# EAGLE design USB-to-Quad-RS-485-Conv-Module (EAGLE 9.6.2)
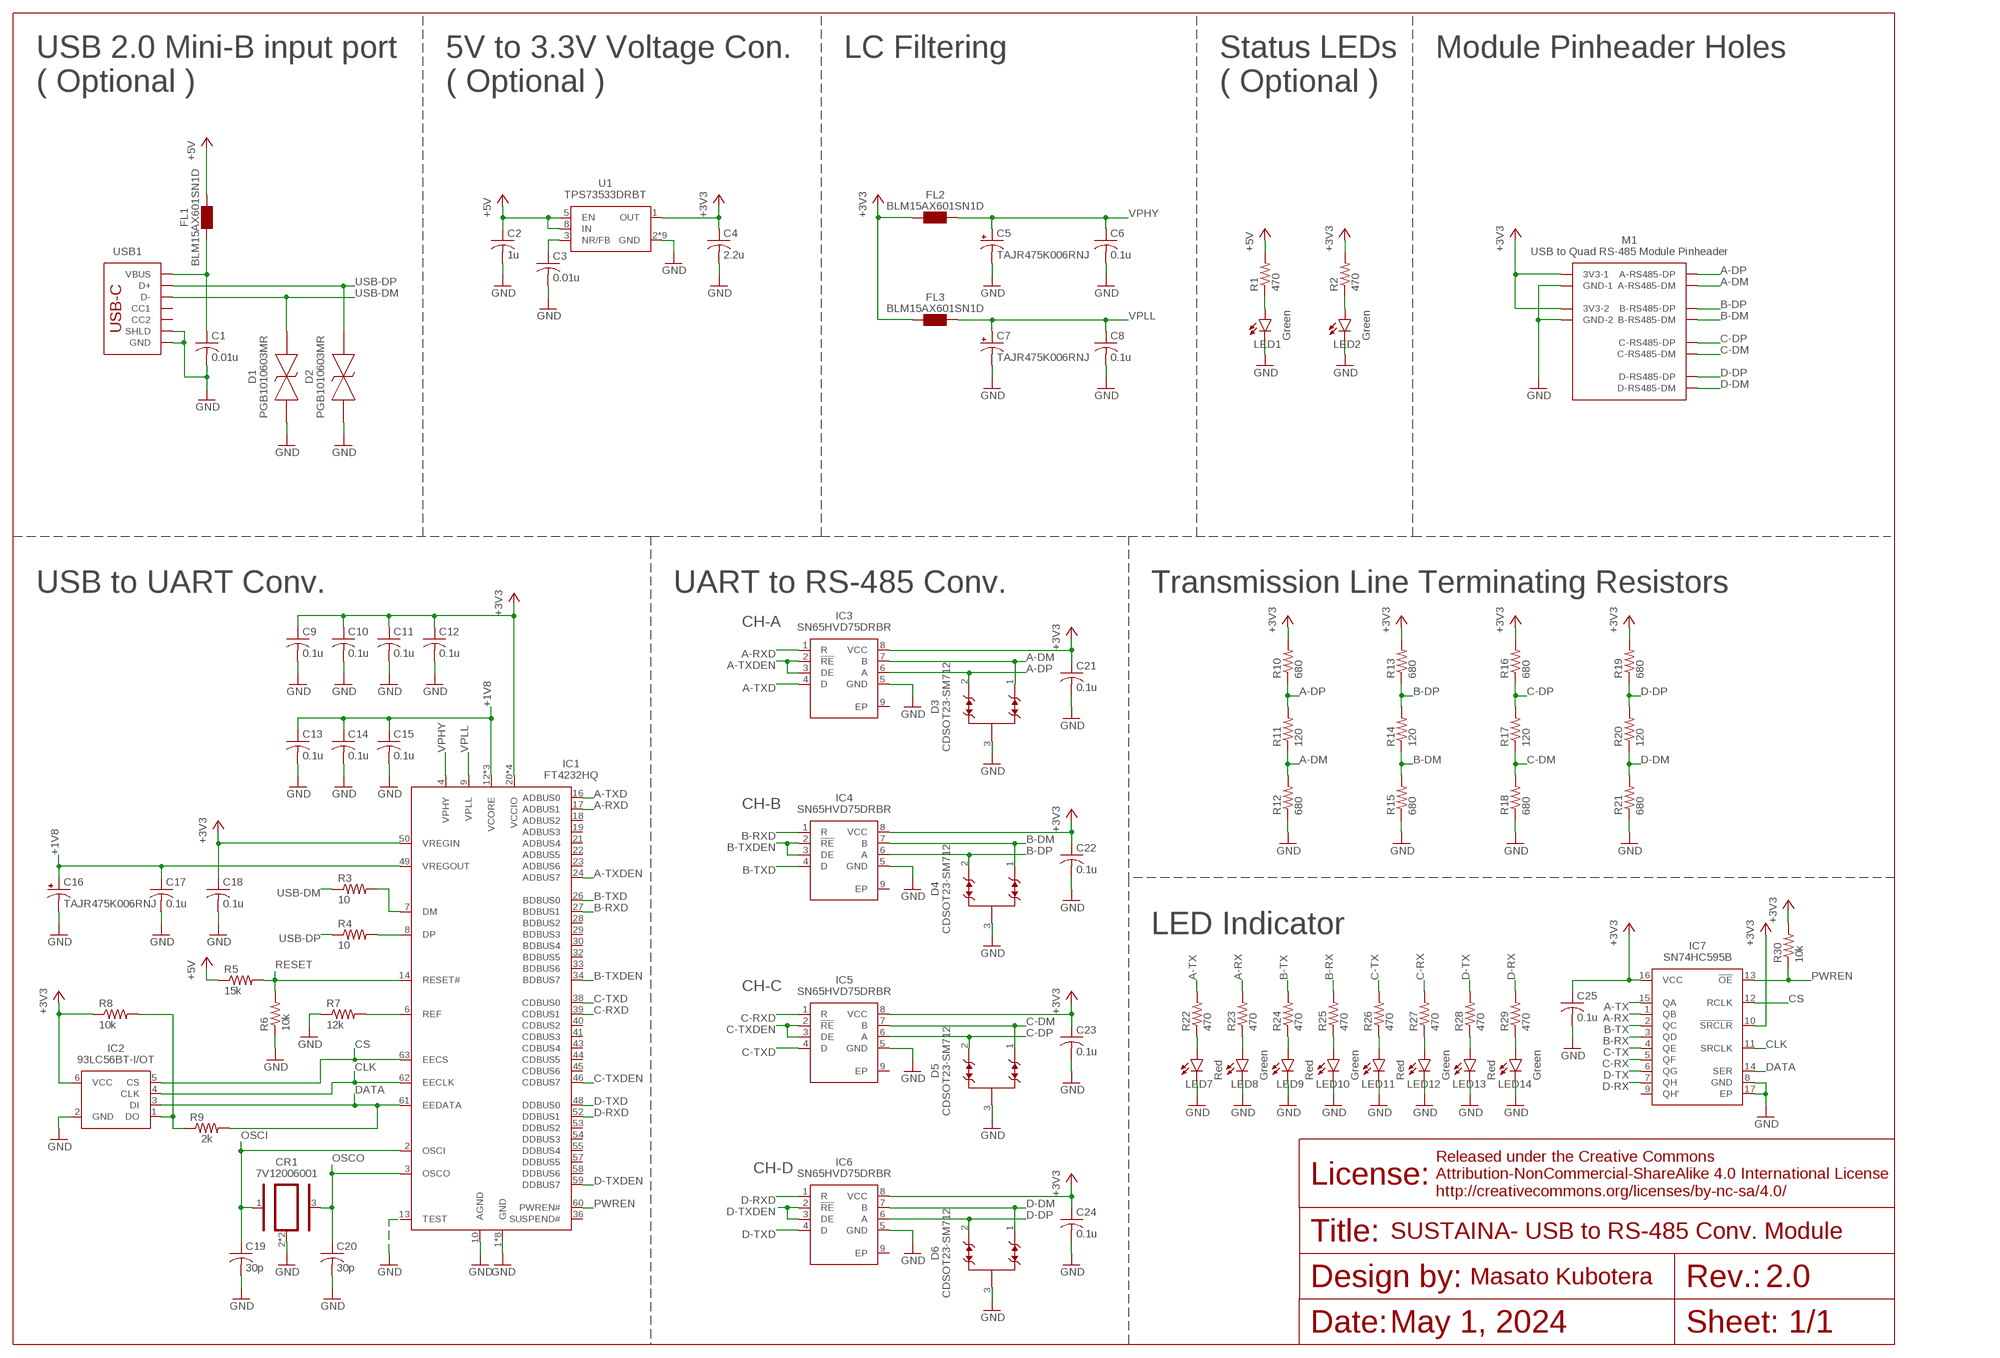
[diagram p0: schematic, sheet 1]

## Parts
C1  0.01u  C-USC0402  [C0402]
C2  1u  C-USC0402  [C0402]
C3  0.01u  C-USC0402  [C0402]
C4  2.2u  C-USC0402  [C0402]
C5  4.7u  TAJR475K006RNJ  [0805K]
C6  0.1u  C-USC0402  [C0402]
C7  4.7u  TAJR475K006RNJ  [0805K]
C8  0.1u  C-USC0402  [C0402]
C9  0.1u  C-USC0402  [C0402]
C10  0.1u  C-USC0402  [C0402]
C11  0.1u  C-USC0402  [C0402]
C12  0.1u  C-USC0402  [C0402]
C13  0.1u  C-USC0402  [C0402]
C14  0.1u  C-USC0402  [C0402]
C15  0.1u  C-USC0402  [C0402]
C16  4.7u  TAJR475K006RNJ  [0805K]
C17  0.1u  C-USC0402  [C0402]
C18  0.1u  C-USC0402  [C0402]
C19  30p  C-USC0402  [C0402]
C20  30p  C-USC0402  [C0402]
C21  0.1u  C-USC0402  [C0402]
C22  0.1u  C-USC0402  [C0402]
C23  0.1u  C-USC0402  [C0402]
C24  0.1u  C-USC0402  [C0402]
C25  0.1u  C-USC0402  [C0402]
CR1  7V12006001  [7V12006001]
D1  PGB1010603MR  [0603]
D2  PGB1010603MR  [0603]
D3  CDSOT23-SM712  [SOT-23-3]
D4  CDSOT23-SM712  [SOT-23-3]
D5  CDSOT23-SM712  [SOT-23-3]
D6  CDSOT23-SM712  [SOT-23-3]
FL1  BLM15AX601SN1D  [BLM15AX601SN1D]
FL2  BLM15AX601SN1D  [BLM15AX601SN1D]
FL3  BLM15AX601SN1D  [BLM15AX601SN1D]
IC1  FT4232HQ  [FT4232HQ]
IC2  93LC56BT-I/OT  [SOT-23-6]
IC3  SN65HVD75DRBR  [SON65P300X300X100-9N]
IC4  SN65HVD75DRBR  [SON65P300X300X100-9N]
IC5  SN65HVD75DRBR  [SON65P300X300X100-9N]
IC6  SN65HVD75DRBR  [SON65P300X300X100-9N]
IC7  SN74HC595B  [QFN40P250X250X50-17N]
LED1  Green  LEDSML0603  [SML0603]
LED2  Green  LEDSML0603  [SML0603]
LED7  Red  LEDSML0603  [SML0603]
LED8  Green  LEDSML0603  [SML0603]
LED9  Red  LEDSML0603  [SML0603]
LED10  Green  LEDSML0603  [SML0603]
LED11  Red  LEDSML0603  [SML0603]
LED12  Green  LEDSML0603  [SML0603]
LED13  Red  LEDSML0603  [SML0603]
LED14  Green  LEDSML0603  [SML0603]
M1  USB-TO-QUAD-RS-485-CONV-MODULEDIMENSION  [USB-TO-QUAD-RS-485-CONV-MODULE-DIMENSION]
R1  470  R-US_R0402  [R0402]
R2  470  R-US_R0402  [R0402]
R3  10  R-US_R0402  [R0402]
R4  10  R-US_R0402  [R0402]
R5  15k  R-US_R0402  [R0402]
R6  10k  R-US_R0402  [R0402]
R7  12k  R-US_R0402  [R0402]
R8  10k  R-US_R0402  [R0402]
R9  2k  R-US_R0402  [R0402]
R10  680  R-US_R0402  [R0402]
R11  120  R-US_R0402  [R0402]
R12  680  R-US_R0402  [R0402]
R13  680  R-US_R0402  [R0402]
R14  120  R-US_R0402  [R0402]
R15  680  R-US_R0402  [R0402]
R16  680  R-US_R0402  [R0402]
R17  120  R-US_R0402  [R0402]
R18  680  R-US_R0402  [R0402]
R19  680  R-US_R0402  [R0402]
R20  120  R-US_R0402  [R0402]
R21  680  R-US_R0402  [R0402]
R22  470  R-US_R0402  [R0402]
R23  470  R-US_R0402  [R0402]
R24  470  R-US_R0402  [R0402]
R25  470  R-US_R0402  [R0402]
R26  470  R-US_R0402  [R0402]
R27  470  R-US_R0402  [R0402]
R28  470  R-US_R0402  [R0402]
R29  470  R-US_R0402  [R0402]
R30  10k  R-US_R0402  [R0402]
U1  TPS73533DRBT  [SON-8]
USB1  USB-C-2.0  [USB-C-2.0]

## Nets
+1V8 [power]: C13.1 C14.1 C15.1 C16.1(+) C17.1 IC1.12(VCORE) IC1.37(VCORE) IC1.49(VREGOUT) IC1.64(VCORE)
+3V3 [power]: C4.1 C9.1 C10.1 C11.1 C12.1 C18.1 C21.1 C22.1 C23.1 C24.1 C25.1 FL2.1 FL3.1 IC1.20(VCCIO) IC1.31(VCCIO) IC1.42(VCCIO) IC1.50(VREGIN) IC1.56(VCCIO) IC2.6(VCC) IC3.8(VCC) IC4.8(VCC) IC5.8(VCC) IC6.8(VCC) IC7.10(!SRCLR) IC7.16(VCC) M1.3V3-1 M1.3V3-2 R2.2 R8.1 R10.2 R13.2 R16.2 R19.2 R30.2 U1.1(OUT)
+5V [high-power]: C2.1 FL1.2 R1.2 R5.1 U1.5(EN) U1.8(IN)
A-DM [signal]: D3.1 IC3.7(B) M1.A-RS-485-DM(A-RS485-DM) R11.1 R12.2
A-DP [signal]: D3.2 IC3.6(A) M1.A-RS-485-DP(A-RS485-DP) R10.1 R11.2
A-RX: IC7.1(QB) R23.2
A-RXD [signal]: IC1.17(ADBUS1) IC3.1(R)
A-TX: IC7.15(QA) R22.2
A-TXD [signal]: IC1.16(ADBUS0) IC3.4(D)
A-TXDEN [signal]: IC1.24(ADBUS7) IC3.2(!RE) IC3.3(DE)
B-DM [signal]: D4.1 IC4.7(B) M1.B-RS-485-DM(B-RS485-DM) R14.1 R15.2
B-DP [signal]: D4.2 IC4.6(A) M1.B-RS-485-DP(B-RS485-DP) R13.1 R14.2
B-RX: IC7.3(QD) R25.2
B-RXD [signal]: IC1.27(BDBUS1) IC4.1(R)
B-TX: IC7.2(QC) R24.2
B-TXD [signal]: IC1.26(BDBUS0) IC4.4(D)
B-TXDEN [signal]: IC1.34(BDBUS7) IC4.2(!RE) IC4.3(DE)
C-DM [signal]: D5.1 IC5.7(B) M1.C-RS-485-DM(C-RS485-DM) R17.1 R18.2
C-DP [signal]: D5.2 IC5.6(A) M1.C-RS-485-DP(C-RS485-DP) R16.1 R17.2
C-RX: IC7.5(QF) R27.2
C-RXD [signal]: IC1.39(CDBUS1) IC5.1(R)
C-TX: IC7.4(QE) R26.2
C-TXD [signal]: IC1.38(CDBUS0) IC5.4(D)
C-TXDEN [signal]: IC1.46(CDBUS7) IC5.2(!RE) IC5.3(DE)
CLK [signal]: IC1.62(EECLK) IC2.4(CLK) IC7.11(SRCLK)
CS [signal]: IC1.63(EECS) IC2.5(CS) IC7.12(RCLK)
D-DM [signal]: D6.1 IC6.7(B) M1.D-RS-485-DM(D-RS485-DM) R20.1 R21.2
D-DP [signal]: D6.2 IC6.6(A) M1.D-RS-485-DP(D-RS485-DP) R19.1 R20.2
D-RX: IC7.7(QH) R29.2
D-RXD [signal]: IC1.52(DDBUS1) IC6.1(R)
D-TX: IC7.6(QG) R28.2
D-TXD [signal]: IC1.48(DDBUS0) IC6.4(D)
D-TXDEN [signal]: IC1.59(DDBUS7) IC6.2(!RE) IC6.3(DE)
DATA [signal]: IC1.61(EEDATA) IC2.3(DI) IC7.14(SER) R9.2
FT4232H-DM [signal]: IC1.7(DM) R3.2
FT4232H-DP [signal]: IC1.8(DP) R4.2
FT4232H-REF [signal]: IC1.6(REF) R7.2
GND [power]: C1.2 C2.2 C3.2 C4.2 C5.2(-) C6.2 C7.2(-) C8.2 C9.2 C10.2 C11.2 C12.2 C13.2 C14.2 C15.2 C16.2(-) C17.2 C18.2 C19.2 C20.2 C21.2 C22.2 C23.2 C24.2 C25.2 CR1.2 CR1.4 D1.1 D2.1 D3.3 D4.3 D5.3 D6.3 IC1.1(GND) IC1.5(GND) IC1.10(AGND) IC1.11(GND) IC1.13(TEST) IC1.15(GND) IC1.25(GND) IC1.35(GND) IC1.47(GND) IC1.51(GND) IC2.2(GND) IC3.5(GND) IC4.5(GND) IC5.5(GND) IC6.5(GND) IC7.8(GND) IC7.17(EP) LED1.C LED2.C LED7.C LED8.C LED9.C LED10.C LED11.C LED12.C LED13.C LED14.C M1.GND-1 M1.GND-2 R6.1 R7.1 R12.1 R15.1 R18.1 R21.1 U1.2(GND) U1.4(GND) U1.6(GND) U1.7(GND) U1.9(GND) U1.10(GND) U1.11(GND) U1.12(GND) U1.13(GND) USB1.GND USB1.GND2(GND) USB1.SHLD1(SHLD) USB1.SHLD2(SHLD) USB1.SHLD3(SHLD) USB1.SHLD4(SHLD) USB1.SHLD5(SHLD) USB1.SHLD6(SHLD) USB1.SHLD7(SHLD) USB1.SHLD8(SHLD)
LED-A-RX [low-power]: LED8.A R23.1
LED-A-TX [low-power]: LED7.A R22.1
LED-B-RX [low-power]: LED10.A R25.1
LED-B-TX [low-power]: LED9.A R24.1
LED-C-RX [low-power]: LED12.A R27.1
LED-C-TX [low-power]: LED11.A R26.1
LED-D-RX [low-power]: LED14.A R29.1
LED-D-TX [low-power]: LED13.A R28.1
LED_3V3: LED2.A R2.1
LED_5V: LED1.A R1.1
NR/FB [power]: C3.1 U1.3(NR/FB)
OSCI [signal]: C19.1 CR1.1 IC1.2(OSCI)
OSCO [signal]: C20.1 CR1.3 IC1.3(OSCO)
PULLUP-DATA [signal]: IC2.1(DO) R8.2 R9.1
PWREN [signal]: IC1.60(PWREN#) IC7.13(!OE) R30.1
RESET [signal]: IC1.14(RESET#) R5.2 R6.2
USB-DM [signal]: D1.2 R3.1 USB1.A7(D-) USB1.B7(D-)
USB-DP [signal]: D2.2 R4.1 USB1.A6(D+) USB1.B6(D+)
VBUS [high-power]: C1.1 FL1.1 USB1.VBUS1(VBUS) USB1.VBUS2(VBUS)
VPHY [power]: C5.1(+) C6.1 FL2.2 IC1.4(VPHY)
VPLL [power]: C7.1(+) C8.1 FL3.2 IC1.9(VPLL)
Unconnected: IC1.18(ADBUS2) IC1.19(ADBUS3) IC1.21(ADBUS4) IC1.22(ADBUS5) IC1.23(ADBUS6) IC1.28(BDBUS2) IC1.29(BDBUS3) IC1.30(BDBUS4) IC1.32(BDBUS5) IC1.33(BDBUS6) IC1.36(SUSPEND#) IC1.40(CDBUS2) IC1.41(CDBUS3) IC1.43(CDBUS4) IC1.44(CDBUS5) IC1.45(CDBUS6) IC1.53(DDBUS2) IC1.54(DDBUS3) IC1.55(DDBUS4) IC1.57(DDBUS5) IC1.58(DDBUS6) IC3.9(EP) IC4.9(EP) IC5.9(EP) IC6.9(EP) IC7.9(QH') USB1.A5(CC1) USB1.B5(CC2)

## Notes on the sheet
- USB 2.0 Mini-B input port
  ( Optional )
- 5V to 3.3V Voltage Con.
  ( Optional )
- LC Filtering
- Status LEDs
  ( Optional )
- Module Pinheader Holes
- USB to UART Conv. | UART to RS-485 Conv. | Transmission Line Terminating Resistors
- CH-A
- CH-B
- LED Indicator
- CH-C
- CH-D
- SUSTAINA- USB to RS-485 Conv. Module
- 2.0
- May 1, 2024 | 1/1

## Library data of the parts
C1-C4 C6 C8-C15 C17-C25 = rcl:C-US: CAPACITOR, American symbol; SPICEPREFIX: C
C5 C7 C16 = TAJR475K006RNJ:TAJR475K006RNJ
CR1 = 7V12006001:7V12006001
D1 D2 = PGB1010603MR:PGB1010603MR
D3-D6 = CDSOT23-SM712:CDSOT23-SM712
FL1-FL3 = BLM15AX601SN1D:BLM15AX601SN1D
IC1 = FT4232HQ:FT4232HQ
IC2 = 93LC56B:93LC56BT-I/OT
IC3-IC6 = SN65HVD75DRBR:SN65HVD75DRBR
IC7 = SN74HC595B:SN74HC595B
LED1 LED2 LED7-LED14 = led:LED: LED OSRAM: - CHIPLED LG R971, LG N971, LY N971, LG Q971, LY Q971, LO R971, LY R971 LH N974, LH R974 LS Q976, LO Q976, LY Q976 LO Q996 - Hyper CHIPLED LW Q18S LB Q993, LB Q99A, LB R99A - SideLED LS A670, LO A670, LY A670, LG A670, LP A670 LB A673, LV A673, LT A673, LW A673 LH A674 LY A675 LS A676, LA A676, LO A676, LY A676, LW A676 LS A679, LY A679, LG A679 - Hyper Micro SIDELED® LS Y876, LA Y876, LO Y876, LY Y876 LT Y87S - SmartLED LW L88C, LW L88S LB L89C, LB L89S, LG L890 LS L89K, LO L89K, LY L89K LS L896, LA L896, LO L896, LY L896 - TOPLED LS T670, LO T670, LY T670, LG T670, LP T670 LSG T670, LSP T670, LSY T670, LOP T670, LYG T670 LG T671, LOG T671, LSG T671 LB T673, LV T673, LT T673, LW T673 LH T674 LS T676, LA T676, LO T676, LY T676, LB T676, LH T676, LSB T676, LW T676 LB T67C, LV T67C, LT T67C, LS T67K, LO T67K, LY T67K, LW E67C LS E67B, LA E67B, LO E67B, LY E67B, LB E67C, LV E67C, LT E67C LW T67C LS T679, LY T679, LG T679 LS T770, LO T770, LY T770, LG T770, LP T770 LB T773, LV T773, LT T773, LW T773 LH T774 LS E675, LA E675, LY E675, LS T675 LS T776, LA T776, LO T776, LY T776, LB T776 LHGB T686 LT T68C, LB T68C - Hyper Mini TOPLED® LB M676 - Mini TOPLED Santana® LG M470 LS M47K, LO M47K, LY M47K Source: http://www.osram.convergy.de LUXEON: - LUMILED® LXK2-PW12-R00, LXK2-PW12-S00, LXK2-PW14-U00, LXK2-PW14-V00 LXK2-PM12-R00, LXK2-PM12-S00, LXK2-PM14-U00 LXK2-PE12-Q00, LXK2-PE12-R00, LXK2-PE12-S00, LXK2-PE14-T00, LXK2-PE14-U00 LXK2-PB12-K00, LXK2-PB12-L00, LXK2-PB12-M00, LXK2-PB14-N00, LXK2-PB14-P00, LXK2-PB14-Q00 LXK2-PR12-L00, LXK2-PR12-M00, LXK2-PR14-Q00, LXK2-PR14-R00 LXK2-PD12-Q00, LXK2-PD12-R00, LXK2-PD12-S00 LXK2-PH12-R00, LXK2-PH12-S00 LXK2-PL12-P00, LXK2-PL12-Q00, LXK2-PL12-R00 Source: www.luxeon.com KINGBRIGHT: KA-3528ASYC Source: www.kingbright.com
M1 = USB-to-Quad-RS-485-Conv-Module:USB-TO-QUAD-RS-485-CONV-MODULE
R1-R30 = rcl:R-US_: RESISTOR, American symbol; SPICEPREFIX: R
U1 = TPS73533DRBT:TPS73533DRBT
USB1 = USB-Connecters:USB-C-2.0

## Net classes
2 power: width 0.203 mm
4 high-power: width 0.508 mm

## Board
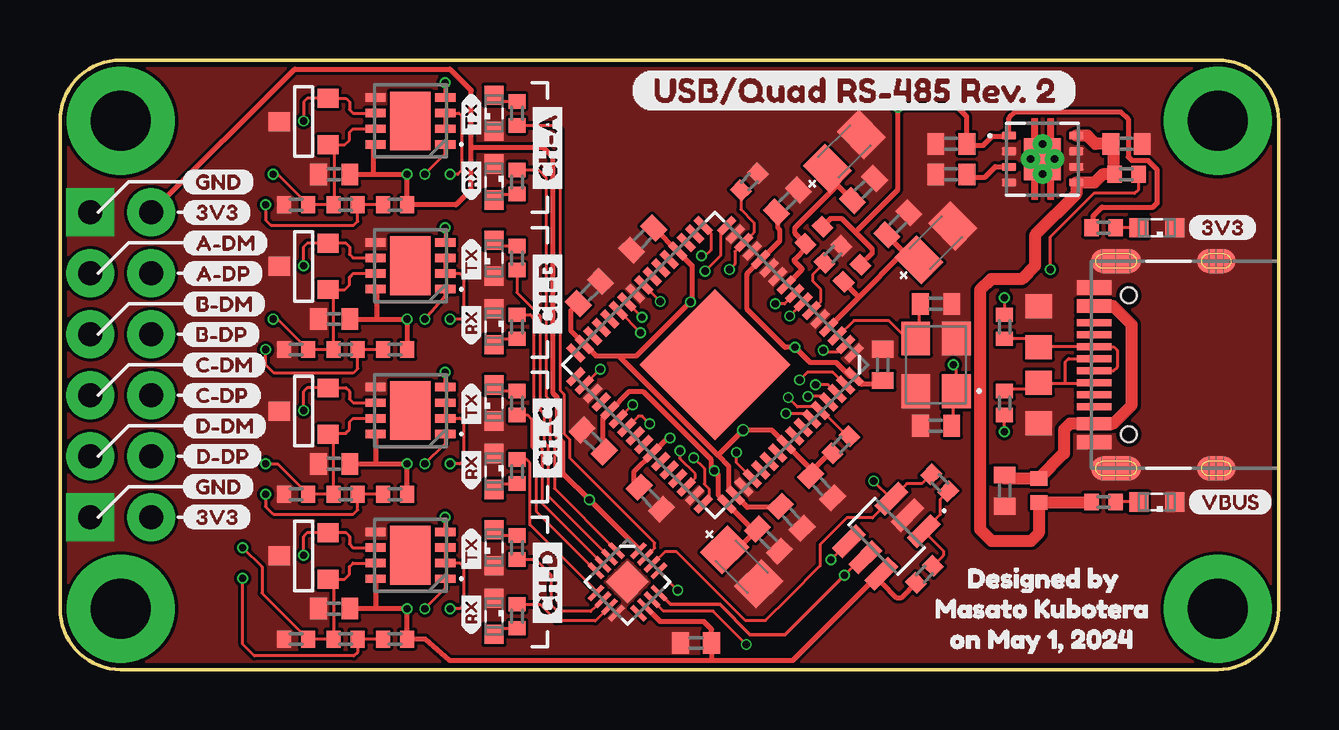
[diagram p1: board, top side]
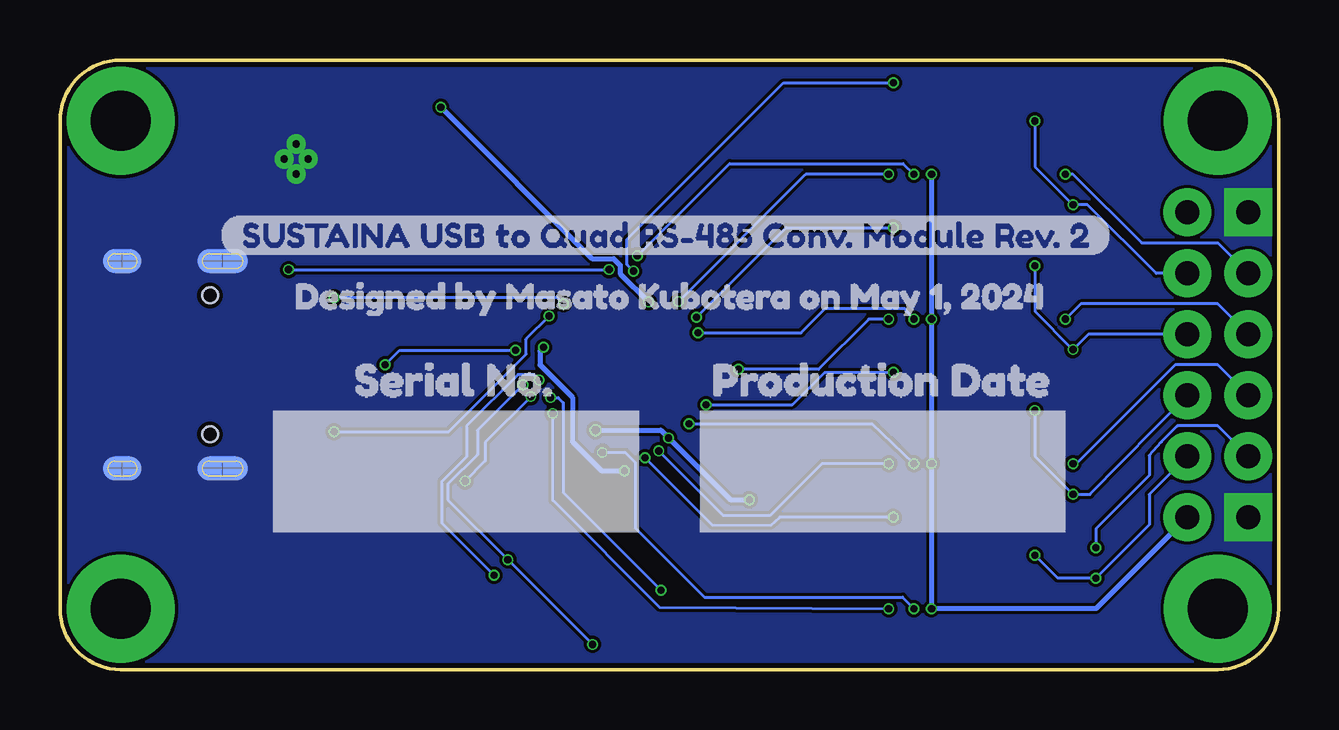
[diagram p2: board, bottom side, seen from below]

Size 50.8 x 25.4 mm. Coordinates in mm from the lower left corner, seen from the top.
Copper layers (1*16): Top 0.035mm / dielectric 1.6mm / Bottom 0.035mm
Design rules "jlcpcb-2layers": minimum track width 5mil, minimum drill 0.3mm, track to track 5mil, track to pad 5mil, pad to pad 5mil, via to via 5mil, smd to smd 5mil, copper to edge 0.2mm, drill to drill 6mil, minimum pad ring 10mil, minimum via ring 3mil, stop-mask expansion 4mil, vias tented up to drill 0mil, thermal gap 10mil

### Footprints (pad centres in the part's own frame; a part is rotated, then mirrored left to right if it is on the bottom)
C0402 = smd 0.7 x 0.9: 1 -0.65,0; 2 0.65,0
0805K = smd 1.3 x 1.6: 1 -1,0; 2 1,0
7V12006001 = smd 1.4 x 1.2: 1 -1.1,-0.85; 2 1.1,-0.85; 3 1.1,0.85; 4 -1.1,0.85
0603 = smd 1 x 1.1: 1 -0.85,0; 2 0.85,0
SOT-23-3 = smd 0.787 x 0.889: 1 0.991,1.016; 2 -0.94,1.016; 3 0.025,-1.016
BLM15AX601SN1D = smd 0.6 x 0.7: 1 -0.5,0; 2 0.5,0
FT4232HQ = smd 0.85 x 0.3: 1 -4.45,3.75; 2 -4.45,3.25; 3 -4.45,2.75; 4 -4.45,2.25; 5 -4.45,1.75; 6 -4.45,1.25; 7 -4.45,0.75; 8 -4.45,0.25; 9 -4.45,-0.25; 10 -4.45,-0.75; 11 -4.45,-1.25; 12 -4.45,-1.75; 13 -4.45,-2.25; 14 -4.45,-2.75; 15 -4.45,-3.25; 16 -4.45,-3.75; 33 4.45,-3.75; 34 4.45,-3.25; 35 4.45,-2.75; 36 4.45,-2.25; 37 4.45,-1.75; 38 4.45,-1.25; 39 4.45,-0.75; 40 4.45,-0.25; 41 4.45,0.25; 42 4.45,0.75; 43 4.45,1.25; 44 4.45,1.75; 45 4.45,2.25; 46 4.45,2.75; 47 4.45,3.25; 48 4.45,3.75 | smd 0.3 x 0.85: 17 -3.75,-4.45; 18 -3.25,-4.45; 19 -2.75,-4.45; 20 -2.25,-4.45; 21 -1.75,-4.45; 22 -1.25,-4.45; 23 -0.75,-4.45; 24 -0.25,-4.45; 25 0.25,-4.45; 26 0.75,-4.45; 27 1.25,-4.45; 28 1.75,-4.45; 29 2.25,-4.45; 30 2.75,-4.45; 31 3.25,-4.45; 32 3.75,-4.45; 49 3.75,4.45; 50 3.25,4.45; 51 2.75,4.45; 52 2.25,4.45; 53 1.75,4.45; 54 1.25,4.45; 55 0.75,4.45; 56 0.25,4.45; 57 -0.25,4.45; 58 -0.75,4.45; 59 -1.25,4.45; 60 -1.75,4.45; 61 -2.25,4.45; 62 -2.75,4.45; 63 -3.25,4.45; 64 -3.75,4.45 | smd 4.45 x 4.45: 65 0,0
SOT-23-6 = smd 1.4 x 0.6: 1 -1.25,0.95; 2 -1.25,0; 3 -1.25,-0.95; 4 1.25,-0.95; 5 1.25,0; 6 1.25,0.95
SON65P300X300X100-9N = smd 0.85 x 0.35: 1 -1.45,0.975; 2 -1.45,0.325; 3 -1.45,-0.325; 4 -1.45,-0.975; 5 1.45,-0.975; 6 1.45,-0.325; 7 1.45,0.325; 8 1.45,0.975 | smd 1.7 x 2.45: 9 0,0
QFN40P250X250X50-17N = smd 0.8 x 0.2: 1 -1.25,0.6; 2 -1.25,0.2; 3 -1.25,-0.2; 4 -1.25,-0.6; 9 1.25,-0.6; 10 1.25,-0.2; 11 1.25,0.2; 12 1.25,0.6 | smd 0.2 x 0.8: 5 -0.6,-1.25; 6 -0.2,-1.25; 7 0.2,-1.25; 8 0.6,-1.25; 13 0.6,1.25; 14 0.2,1.25; 15 -0.2,1.25; 16 -0.6,1.25 | smd 1.25 x 1.25: 17 0,0
SML0603 = smd 0.8 x 0.8: A 0.75,0; C -0.75,0
USB-TO-QUAD-RS-485-CONV-MODULE-DIMENSION = drill 1 pad 2: 3V3-1 3.81,6.35; 3V3-2 3.81,-6.35; A-RS-485-DM 1.27,3.81; A-RS-485-DP 3.81,3.81; B-RS-485-DM 1.27,1.27; B-RS-485-DP 3.81,1.27; C-RS-485-DM 1.27,-1.27; C-RS-485-DP 3.81,-1.27; D-RS-485-DM 1.27,-3.81; D-RS-485-DP 3.81,-3.81 | drill 1 pad 2 square: GND-1 1.27,6.35; GND-2 1.27,-6.35 | drill 2.5 pad 4.5: H1 2.54,10.16; H2 2.54,-10.16; H3 48.26,10.16; H4 48.26,-10.16
R0402 = smd 0.6 x 0.7: 1 -0.5,0; 2 0.5,0
SON-8 = smd 0.6 x 0.31: 1 -1.4,0.975; 2 -1.4,0.325; 3 -1.4,-0.325; 4 -1.4,-0.975; 5 1.4,-0.975; 6 1.4,-0.325; 7 1.4,0.325; 8 1.4,0.975 | smd 1.5 x 1.75: 9 0,0 | drill 0.3: 10 0,0.625; 11 0.5,0; 12 -0.5,0; 13 0,-0.625
USB-C-2.0 = smd 0.3 x 1.45: A5 -1.25,7.695; A6 -0.25,7.695; A7 0.25,7.695; A8 1.25,7.695; B5 1.75,7.695; B6 0.75,7.695; B7 -0.75,7.695; B8 -1.75,7.695 | smd 0.6 x 1.45: GND -3.225,7.695; GND2 3.225,7.695 | smd 1 x 2.1: SHLD1 -4.32,6.78; SHLD2 4.32,6.78 | smd 1 x 2.1 bottom: SHLD3 -4.32,6.78; SHLD4 4.32,6.78 | smd 1 x 1.6: SHLD5 -4.32,2.6; SHLD8 4.32,2.6 | smd 1 x 1.6 bottom: SHLD6 -4.32,2.6; SHLD7 4.32,2.6 | smd 0.55 x 1.45: VBUS1 -2.45,7.695; VBUS2 2.45,7.695 | hole 0.65: -2.89,6.25; 2.89,6.25

### Placement (x,y rotation side)
C1  39.37,7.46 270 top
C2  44.45,21.91 0 top
C3  37.15,20.64 180 top
C4  37.15,21.91 180 top
C5  36.51,17.78 45 top
C6  34.92,18.57 45 top
C7  32.7,21.59 45 top
C8  33.5,20 45 top
C9  24.61,7.14 315 top
C10  24.29,17.94 225 top
C11  22.07,15.72 45 top
C12  31.75,7.62 315 top
C13  30.32,19.53 45 top
C14  34.29,12.7 90 top
C15  22.23,9.52 135 top
C16  28.42,4.29 315 top
C17  29.53,5.4 315 top
C18  30.48,6.35 315 top
C19  36.51,10.16 180 top
C20  36.51,15.24 0 top
C21  11.43,20.64 180 top
C22  11.43,14.6 180 top
C23  11.43,8.57 180 top
C24  11.43,2.54 180 top
C25  26.51,1.11 180 top
CR1  36.51,12.7 90 top
D1  40.8,11.11 90 top
D2  40.8,14.29 270 top
D3  10.16,22.86 270 top
D4  10.16,16.83 270 top
D5  10.16,10.79 270 top
D6  10.16,4.76 270 top
FL1  40.8,7.46 270 top
FL2  33.02,16.51 225 top
FL3  31.43,18.1 225 top
IC1  27.3,12.7 225 top
IC2  34.45,5.56 225 top
IC3  14.61,22.86 180 top
IC4  14.61,16.83 180 top
IC5  14.61,10.79 180 top
IC6  14.61,4.76 180 top
IC7  23.65,3.65 315 top
LED1  45.72,6.98 180 top
LED2  45.72,18.41 180 top
LED7  18.1,23.18 90 top
LED8  18.1,20.32 270 top
LED9  18.1,17.14 90 top
LED10  18.1,14.29 270 top
LED11  18.1,11.11 90 top
LED12  18.1,8.25 270 top
LED13  18.1,5.08 90 top
LED14  18.1,2.22 270 top
M1  0,12.7 0 top
R1  43.5,6.98 180 top
R2  43.5,18.41 180 top
R3  39.37,11.11 270 top
R4  39.37,14.29 90 top
R5  44.45,20.64 0 top
R6  28.73,20.32 225 top
R7  32.23,17.3 225 top
R8  36.04,3.97 45 top
R9  36.67,7.78 135 top
R10  13.97,19.37 0 top
R11  11.91,19.37 0 top
R12  9.84,19.37 0 top
R13  13.97,13.33 0 top
R14  11.91,13.33 0 top
R15  9.84,13.33 0 top
R16  13.97,7.3 0 top
R17  11.91,7.3 0 top
R18  9.84,7.3 0 top
R19  13.97,1.27 0 top
R20  11.91,1.27 0 top
R21  9.84,1.27 0 top
R22  19.05,23.18 270 top
R23  19.05,20.32 90 top
R24  19.05,17.14 270 top
R25  19.05,14.29 90 top
R26  19.05,11.11 270 top
R27  19.05,8.25 90 top
R28  19.05,5.08 270 top
R29  19.05,2.22 90 top
R30  32.54,9.37 225 top
U1  40.96,21.27 0 top
U$1  [DESIGNED_BY_MASATO_KUBOTERA_ON_MAY_1-COLUMN]  40.96,2.54 0 top
U$3  CH#A0  [CH#A0]  20.32,19.68 90 top
U$4  CH#B0  [CH#B0]  20.32,13.65 90 top
U$5  CH#C0  [CH#C0]  20.32,7.62 90 top
U$6  CH#D0  [CH#D0]  20.32,1.59 90 top
U$7  [D-DM-0.025]  5.08,10.16 0 top
U$8  [D-DP-0.025]  5.08,8.89 0 top
U$9  [USB#QUAD_RS#485_REV#_2]  23.81,24.13 0 top
U$11  RX0  [RX0]  17.14,19.53 90 top
U$12  TX0  [TX0]  17.14,22.07 90 top
U$13  RX0  [RX0]  17.14,13.49 90 top
U$14  TX0  [TX0]  17.14,16.03 90 top
U$15  RX0  [RX0]  17.14,7.46 90 top
U$16  TX0  [TX0]  17.14,10 90 top
U$17  RX0  [RX0]  17.14,1.43 90 top
U$18  TX0  [TX0]  17.14,3.97 90 top
U$23  [3V3_0.025]  5.08,19.05 0 top
U$24  [3V3_0.025]  5.08,6.35 0 top
U$25  [GND_0.025]  5.08,20.32 0 top
U$26  [GND_0.025]  5.08,7.62 0 top
U$27  USB_TO_QUAD_RS#485_CONV#_MODULE_REV#_20  [SUSTAINA_USB_TO_QUAD_RS#485_CONV#_MODULE_REV#_2]  44.13,18.1 0 bottom
U$28  [A-DM-0.025]  5.08,17.78 0 top
U$29  PRODUCTION_DATE0  [PRODUCTION_DATE0]  24.77,12.06 0 bottom
U$30  SERIAL_NO#0  [SERIAL_NO#0]  39.69,12.06 0 bottom
U$31  [3V3_0.025]  46.99,18.41 0 top
U$32  [C-DP-0.025]  5.08,11.43 0 top
U$33  [DESIGNED_BY_MASATO_KUBOTERA_ON_MAY_1]  41.91,15.56 0 bottom
U$34  [A-DP-0.025]  5.08,16.51 0 top
U$35  [C-DM-0.025]  5.08,12.7 0 top
U$36  [B-DP-0.025]  5.08,13.97 0 top
U$37  [B-DM-0.025]  5.08,15.24 0 top
U$38  [VBUS_0.025]  46.99,6.98 0 top
USB1  50.8,12.7 90 top

### Tracks (layer width: path | path; a pad name or v marks a point on that pad's centre or on a via)
+1V8  (via drill 0.3)
  Top 0.203: C14.1 34.13,11.89 33.42,11.89 IC1.64 32.95,12.21 32.35,12.79 31.27,12.79 v30.64,13.43 30.23,13.43 28.64,15.02 28.64,16.45 28.64,16.51 IC1.12 30,17.88 30,18.32 29.91,18.41 29.91,19.02 C13.1 | C15.1 22.64,9.11 22.64,10.51 IC1.37 23.7,11.57 24.32,11.57 27.15,8.74 27.15,8.41 v27.27,8.29 27.43,8.13 27.43,7.27 IC1.49 28.75,5.95 28.98,5.95 C17.1 27.96,4.75 C16.1
  Bottom 0.203: v30.64,13.43 30.8,13.27 30.8,12.7 29.44,11.34 29.44,9.49 28.23,8.29 v27.27,8.29
+3V3  (via drill 0.3, 0.35)
  Top 0.203: IC7.10 25.02,2 26.84,2 27.16,1.68 C25.1 27.16,0.38 | R8.1 35.05,2.98 34.89,2.98 34.24,3.63 IC2.6 34.16,4 30.54,0.38 27.16,0.38 | IC5.8 13.15,8.57 | IC6.8 13.15,2.54 | 13.15,2.54 v14.47,2.54 R19.2 15.22,1.27 16.23,0.38 27.16,0.38 | 13.15,2.54 C24.1 12.19,2.6 | IC7.16 24.15,5 v22.07,7.08 20.95,8.19 20.95,9.48 20.72,9.71 20.72,11.35 20.56,11.51 20.56,21.34 20.15,21.75 17.14,21.75 | R30.2 32.13,8.95 32,8.95 31.19,8.14 C12.1 | C12.1 31.43,8.22 IC1.56 29.68,9.98 v28.48,9.98 27.43,8.92 | 30.07,6.89 C18.1 30,6.76 28.65,6.76 IC1.50 27.87,7.54 27.87,8.48 27.43,8.92 | 31.19,8.1 C12.1 | R2.2 43.05,18.41 43.05,18.89 43.43,19.27 45.56,19.27 45.72,19.43 45.72,20.84 45.34,21.22 44.67,21.22 44.52,21.36 44.52,22.94 44.23,23.24 39.81,23.24 39.56,22.98 U1.1 39.5,22.23 38.86,22.23 38.48,21.84 37.91,21.84 37.85,21.91 C4.1 37.8,23.04 37.4,23.43 v34.92,23.43 34.92,20 33.15,18.22 | 13.21,14.6 13.21,15.81 IC4.8 | 33.15,18.22 32.58,18.8 32.13,18.8 FL3.1 31.75,18.54 31.75,18.61 | 33.15,18.22 33.85,17.53 33.85,17.34 FL2.1 | C11.1 21.29,14.94 21.29,14.12 IC1.31 22.34,13.07 23.28,13.07 | C10.1 24.8,18.39 IC1.20 26.35,16.83 26.35,15.4 v26.28,15.32 | 12.13,14.67 C22.1 | 23.28,13.07 27.43,8.92 | 14.47,13.37 R13.2 v14.47,14.6 13.21,14.6 | R16.2 v14.47,8.57 13.15,8.57 | C23.1 13.15,8.57 | C22.1 13.21,14.6 | IC3.8 13.05,21.78 13.05,20.64 | C21.1 13.05,20.64 | 13.05,20.64 v14.47,20.64 v14.48,20.63 R10.2 16.51,19.37 17.14,20 17.14,21.75 | 17.14,21.75 17.14,24.13 16.25,25.02 9.78,25.02 M1.3V3-1 | C22.1 11.9,14.6 | v26.28,15.32 | 23.8,7.6 C9.1 23.93,7.82 23.93,8.27 IC1.42 24.71,9.02 25.34,9.65 v25.43,9.65
  Top 0.203: 23.28,13.07 24.03,13.07 v26.28,15.32
  Bottom 0.203: v22.07,7.08 22.86,7.08 v25.43,9.65 25.75,9.98 v28.48,9.98 | M1.3V3-2 7.62,2.54 v14.47,2.54 v14.47,8.57 v14.47,14.6 v14.47,20.64 | v34.92,23.43 28.62,17.12 27.72,17.12 27.45,16.86 27.45,16.49 v26.28,15.32
+5V
  Top 0.508: R1.2 42.97,6.96 FL1.2 40.8,5.68 40.48,5.37 38.83,5.37 38.35,5.84 38.35,15.81 38.81,16.27 40.08,16.27 40.64,16.83 40.64,18.1 42.36,19.81 U1.5 43.13,20.3 43.47,20.64 R5.1 43.91,20.68 43.91,21.55 C2.1 43.16,21.91 42.83,22.25 U1.8
A-DM  (via drill 0.3)
  Top 0.127: R11.1 11.27,19.37 | 11.27,19.37 R12.2 9.07,20.64 v8.89,20.64 | 11.05,21.72 11.18,21.84 D3.1 | D3.1 11.43,21.61 11.43,19.53 11.27,19.37 | D3.1 11.87,21.87 12.06,22.07 12.06,22.38 12.22,22.54 IC3.7
  Bottom 0.127: v8.89,20.64 8.57,20.64 5.71,17.78 4.76,17.78 | 4.76,17.78 | 4.76,17.78 2.54,17.78 M1.A-RS-485-DM
A-DP  (via drill 0.3)
  Top 0.127: R10.1 R11.2 12.41,18.68 12.25,18.52 8.79,18.52 8.57,18.73 v8.57,19.37 8.57,19.29 | v10.16,22.86 10.16,23.65 10.31,23.8 D3.2 11.92,23.8 12.06,23.65 12.06,23.34 12.22,23.18 IC3.6
  Bottom 0.127: v10.16,22.86 10.16,20.95 v8.57,19.37 7.97,19.37 5.11,16.51 M1.A-RS-485-DP
A-RX
  Top 0.127: IC7.1 23.15,5.02 20.61,7.56 20.61,9.41 20.43,9.59 20.43,11.23 20.27,11.39 20.27,20.5 19.95,20.82 R23.2
A-RXD  (via drill 0.3)
  Top 0.127: v15.21,20.64 16.05,21.48 IC3.1 | v26.73,17.24 26.89,17.24 27.13,17.48 27.13,18.18 IC1.17
  Bottom 0.127: v15.21,20.64 15.66,21.08 22.89,21.08 v26.73,17.24
A-TX
  Top 0.127: IC7.15 24.78,5.06 24.78,5.28 21.25,8.82 21.25,9.6 21.01,9.83 21.01,11.47 20.85,11.63 20.85,22.46 20.64,22.68 R22.2
A-TXD  (via drill 0.3)
  Top 0.127: IC3.4 v16.05,24.45 | v26.89,16.61 27.53,17.24 27.53,18.26 27.81,18.54 IC1.16
  Bottom 0.127: v16.05,24.45 20.64,24.45 27.16,17.92 27.16,16.87 v26.89,16.61
A-TXDEN  (via drill 0.3)
  Top 0.127: IC3.2 16.07,22.54 16.07,22.61 IC3.2 | IC1.24 v25.02,15.34 | v16.26,20.64 16.57,20.64 16.73,20.8 16.73,23.08 16.63,23.18 IC3.3 16.03,23.18 16.03,22.54 IC3.2
  Bottom 0.127: v25.02,15.34 19.72,20.64 v16.26,20.64
B-DM  (via drill 0.3)
  Top 0.127: v8.89,14.6 9.07,14.6 R15.2 R14.1 11.41,15.84 D4.1 11.87,15.84 12.06,16.03 12.06,16.35 12.22,16.51 13.15,16.51 IC4.7
  Bottom 0.127: v8.89,14.6 8.26,15.24 2.54,15.24 M1.B-RS-485-DM
B-DP  (via drill 0.3)
  Top 0.127: R13.1 R14.2 12.41,12.54 12.22,12.35 8.92,12.35 8.57,12.7 v8.57,13.33 | v10.16,16.83 10.16,17.62 10.31,17.77 D4.2 11.91,17.78 12.06,17.62 12.06,17.3 12.22,17.15 IC4.6
  Bottom 0.127: v10.16,16.83 10.16,14.92 v8.57,13.33 7.94,13.97 M1.B-RS-485-DP
B-RX
  Top 0.127: IC7.3 20.1,6.92 20.1,9.2 19.92,9.38 19.92,10.54 19.75,10.71 19.75,14.64 19.6,14.79 R25.2
B-RXD  (via drill 0.3)
  Top 0.127: IC1.27 v24.2,14.03 | v15.21,14.6 16.05,15.58 IC4.1
  Bottom 0.127: v15.21,14.6 15.6,15.05 18.89,15.05 19.91,14.03 v24.2,14.03
B-TX
  Top 0.127: IC7.2 20.35,7.23 20.35,9.31 20.17,9.49 20.17,10.65 20,10.82 20,14.75 19.05,15.71 R24.2
B-TXD  (via drill 0.3)
  Top 0.127: IC1.26 v24.26,14.68 | v16.05,18.41 IC4.4
  Bottom 0.127: v24.26,14.68 20.53,18.41 v16.05,18.41
B-TXDEN  (via drill 0.3)
  Top 0.127: IC4.2 16.05,16.45 | IC4.2 IC4.3 | IC1.34 v22.52,12.51 | 16.13,16.51 IC4.2 | IC4.2 16.06,16.51 16.67,16.51 16.83,16.35 16.83,14.7 16.73,14.6 v16.26,14.6
  Bottom 0.127: v22.52,12.51 19.18,12.51 17.08,14.6 v16.26,14.6
C-DM  (via drill 0.3)
  Top 0.127: 11.18,9.78 D5.1 | v8.57,8.57 9.07,8.57 R18.2 R17.1 11.41,9.52 11.35,9.47 11.18,9.65 D5.1 | D5.1 11.21,9.84 11.91,9.84 12.06,10 12.06,10.32 12.22,10.47 IC5.7
  Bottom 0.127: M1.C-RS-485-DM 2.54,12.7 4.32,12.7 8.45,8.57 v8.57,8.57
C-DP  (via drill 0.3)
  Top 0.127: R16.1 R17.2 12.41,6.66 12.22,6.48 8.89,6.48 8.57,6.79 v8.57,7.3 | v10.16,10.79 10.16,11.59 10.31,11.73 D5.2 11.19,11.75 11.91,11.75 12.06,11.59 12.06,11.27 12.22,11.12 IC5.6
  Bottom 0.127: M1.C-RS-485-DP 7.87,7.3 v8.57,7.3 10.16,8.89 v10.16,10.79
C-RX
  Top 0.127: IC7.5 22.38,3.24 19.59,6.03 19.59,8.61 19.45,8.75 R27.2
C-RXD  (via drill 0.3)
  Top 0.127: v15.21,8.57 16.05,9.42 IC5.1 | v24.58,10.24 24.26,10.56 24.1,10.56 IC1.39
  Bottom 0.127: v24.58,10.24 16.96,10.24 v15.21,8.57
C-TX
  Top 0.127: IC7.4 22.32,4.13 19.84,6.6 19.84,9.1 19.66,9.28 19.66,10.44 19.49,10.61 R26.2
C-TXD  (via drill 0.3)
  Top 0.127: IC5.4 v16.05,12.38 | IC1.38 v23.87,11.04
  Bottom 0.127: v16.05,12.38 18.92,12.38 20.27,11.04 v23.87,11.04
C-TXDEN  (via drill 0.3)
  Top 0.127: IC5.3 16.07,11.11 16.07,10.48 IC5.2 16.06,10.48 16.67,10.48 16.83,10.32 16.83,8.73 16.67,8.57 v16.26,8.57 | v25.84,9.11 25.84,8.79 26.48,8.16 26.48,7.98 IC1.46
  Bottom 0.127: v25.84,9.11 23.15,6.41 21.21,6.41 19.05,8.57 v16.26,8.57
CLK  (via drill 0.3)
  Top 0.127: v32.13,4.57 IC2.4 | v28.61,1.05 v28.6,1.05 27.22,2.43 25.16,2.43 IC7.11 | IC1.62 32.02,11.87 v31.5,11.87
  Bottom 0.127: v28.61,1.05 v32.13,4.57 34.64,7.08 34.64,7.72 33.4,8.96 33.4,9.97 v31.5,11.87
CS  (via drill 0.3)
  Top 0.127: v32.7,3.94 33.4,4.63 33.53,4.63 IC2.5 | IC1.63 32.22,12.38 31.15,12.38 v30.83,12.06
  Top 0.152: v32.7,3.94 30.23,1.46 28.76,1.46 27.5,2.71 25.44,2.71 IC7.12
  Bottom 0.127: v32.7,3.94 34.89,6.13 34.89,7.83 33.85,8.88 33.85,10.16 31.71,12.29 31.05,12.29 v30.83,12.06
D-DM  (via drill 0.3)
  Top 0.127: 11.18,3.75 D6.1 | v7.62,5.08 8.43,4.27 8.43,3.19 R21.2 R20.1 11.41,3.54 D6.1 | D6.1 11.87,3.77 12.06,3.97 12.06,4.29 12.22,4.44 IC6.7
  Bottom 0.127: M1.D-RS-485-DM 2.54,10.16 4.22,10.16 4.89,9.49 5.4,8.92 5.4,8.1 7.62,5.87 v7.62,5.08
D-DP  (via drill 0.3)
  Top 0.127: R19.1 R20.2 12.41,0.73 12.25,0.57 8.1,0.57 7.62,1.05 v7.62,3.81 | 11.18,5.71 D6.2 | v10.16,4.76 10.16,5.56 10.31,5.7 D6.2 | D6.2 11.19,5.71 11.91,5.71 12.06,5.56 12.06,5.24 12.22,5.09 IC6.6
  Bottom 0.127: M1.D-RS-485-DP 5.4,7.3 5.4,6.03 v7.62,3.81 9.21,3.81 v10.16,4.76
D-RX
  Top 0.127: R29.2 20,2.72 20.69,2.03 22.32,2.03 IC7.7
D-RXD  (via drill 0.3)
  Top 0.127: IC6.1 16.05,3.39 v15.21,2.54 | v28.19,9.05 28.19,8.63 IC1.52
  Bottom 0.127: v15.21,2.54 15.68,3.02 23.94,3.02 26.83,5.9 26.83,8.64 27.24,9.05 v28.19,9.05
D-TX
  Top 0.127: R28.2 19.84,4.58 20.48,3.94 20.48,2.7 20.75,2.43 22.12,2.43 IC7.6
D-TXD  (via drill 0.3)
  Top 0.127: IC6.4 v16.05,6.35 | v26.42,8.83 26.86,8.39 26.86,7.73 27.05,7.53 27.05,7.14 IC1.48
  Bottom 0.127: v16.05,6.35 20.8,6.35 21.16,6.02 23.62,6.03 v26.42,8.83
D-TXDEN  (via drill 0.3)
  Top 0.127: IC6.3 16.07,5.08 16.07,4.44 IC6.2 16.06,4.44 16.67,4.44 16.83,4.29 16.83,2.7 16.67,2.54 v16.26,2.54 | IC1.59 31.28,10.44 31.05,10.67 v30.26,10.67
  Bottom 0.127: v30.26,10.67 30.26,7.05 25.81,2.6 v16.26,2.53 v16.26,2.54
DATA  (via drill 0.3)
  Top 0.127: R9.2 35.93,7.75 35.29,7.74 IC2.3 | IC7.14 25.24,4.92 25.69,4.92 28.56,2.05 29.41,2.05 30.36,3 30.37,3 31.69,4.32 31.69,5.21 32.8,6.32 33.87,6.32 IC2.3 | IC2.3 v33.92,7.86 | v31.17,11.38 31.19,11.39 31.8,11.39 IC1.61
  Bottom 0.127: v33.92,7.86 33.08,8.69 33.08,9.47 v31.17,11.38
FT4232H-DM  (via drill 0.3)
  Top 0.127: v39.37,9.91 R3.2 | v30.42,14.73 30.99,15.3 IC1.7
  Bottom 0.127: v39.37,9.91 34.61,9.91 31.37,13.14 31.37,13.78 v30.42,14.73
FT4232H-DP  (via drill 0.3)
  Top 0.127: v39.37,15.49 R4.2 | v29.81,15.24 30.2,15.24 IC1.8
  Bottom 0.127: v39.37,15.49 30.07,15.49 v29.81,15.24
FT4232H-REF
  Top 0.127: R7.2 31.37,16.45 31.37,16.19 31.72,15.84 31.72,15.33 31.37,14.99 IC1.6
GND
  Top 0.203: 25.08,6.67 C9.2 | 9.37,19.37 R12.1 | 18.1,22.54 LED7.C
  pour Top (no thermals): -1.27,26.67 -1.27,-1.27 52.07,-1.27 52.07,26.67
  pour Bottom (no thermals): -2.54,27.94 -2.54,-2.54 53.34,-2.54 53.34,27.94
LED-A-RX
  Top 0.127: R23.1 18.29,19.81 18.1,19.62 LED8.A
LED-A-TX
  Top 0.127: R22.1 18.29,23.69 18.1,23.88 LED7.A
LED-B-RX
  Top 0.127: R25.1 19.05,13.78 18.29,13.78 18.1,13.59 LED10.A
LED-B-TX
  Top 0.127: R24.1 18.29,17.65 18.1,17.84 LED9.A
LED-C-RX
  Top 0.127: R27.1 18.29,7.75 18.1,7.56 LED12.A
LED-C-TX
  Top 0.127: R26.1 19.05,11.62 18.29,11.62 18.1,11.81 LED11.A
LED-D-RX
  Top 0.127: R29.1 18.29,1.71 18.1,1.52 LED14.A
LED-D-TX
  Top 0.127: R28.1 18.29,5.59 18.1,5.78 LED13.A
LED_3V3
  Top 0.127: LED2.A R2.1
LED_5V
  Top 0.127: LED1.A R1.1
NR/FB
  Top 0.203: U1.3 39.5,20.95 38.99,20.95 38.54,20.51 37.97,20.51 37.85,20.64 C3.1
OSCI  (via drill 0.3)
  Top 0.127: IC1.2 32.43,13.23 31.89,13.23 v31.81,13.3 | v37.24,12.7 37.36,12.7 CR1.1 37.34,11.56 37.21,11.43 37.21,10.16 C19.1
  Bottom 0.127: v31.81,13.3 36.64,13.3 v37.24,12.7
OSCO
  Top 0.127: IC1.3 32.45,13.91 33.08,14.54 34.54,14.54 35.24,13.84 35.62,13.84 CR1.3 35.62,13.91 35.81,14.1 35.81,15.24 C20.1
PULLUP-DATA
  Top 0.127: R8.2 36.81,4.75 36.81,4.96 IC2.1 36.7,6.47 36.7,7.1 R9.1
PWREN  (via drill 0.3)
  Top 0.127: R30.1 32.89,9.78 32.77,9.78 31.75,10.79 | v25.75,3.3 IC7.13 | IC1.60 31.53,10.95 30.74,10.95 v30.35,11.33
  Top 0.152: IC1.60 31.75,10.79
  Bottom 0.127: v25.75,3.3 29.83,7.38 29.83,11.13 30.04,11.33 v30.35,11.33
RESET  (via drill 0.3)
  Top 0.127: R6.2 28.38,19.17 28.92,18.63 28.92,18.21 IC1.14 28.13,17.41 28.13,16.89 v27.91,16.67 | R5.2 44.95,20 44.79,19.84 43.09,19.84 41.27,18.03 v41.27,16.67
  Bottom 0.127: v41.27,16.67 v27.91,16.67
USB-DM
  Top 0.127: R3.1 39.37,11.68 40.51,11.68 40.77,11.94 D1.2 40.83,11.94 41.91,11.94 | 41.91,11.94 43.05,11.94 USB1.B7 | 41.91,11.94 41.91,12.83 42.04,12.95 43.05,12.95 USB1.A7
USB-DP
  Top 0.127: R4.1 39.37,13.78 40.45,13.78 40.77,13.46 D2.2 40.83,13.46 43.05,13.46 USB1.B6 43.92,13.45 44.07,13.3 44.07,12.6 43.91,12.45 USB1.A6
VBUS
  Top 0.508: C1.1 39.37,7.96 FL1.1 41.85,9.01 41.85,10 42.09,10.25 USB1.VBUS1 43.9,10.25 44.67,11.02 44.67,14.38 43.9,15.15 USB1.VBUS2
VPHY
  Top 0.203: FL2.2 33.3,15.52 | IC1.4 33.3,15.52 | C6.1 34.36,18.22 34.35,18.22 35.31,17.27 35.69,17.27 C5.1 35.08,17.3 33.3,15.52
VPLL
  Top 0.203: 31.05,17.53 31.05,17.72 FL3.2 | IC1.9 30.94,16.69 30.61,17.02 30.61,17.08 31.08,17.55 FL3.2 | C8.1 33.15,19.44 33.15,19.43 32.19,20.38 32.19,20.77 C7.1 32.34,20.11 30.64,18.41 30.64,18.18 FL3.2